# EAGLE schematic TowerPro 25A (HH30A_V1.1) (EAGLE 6.2)
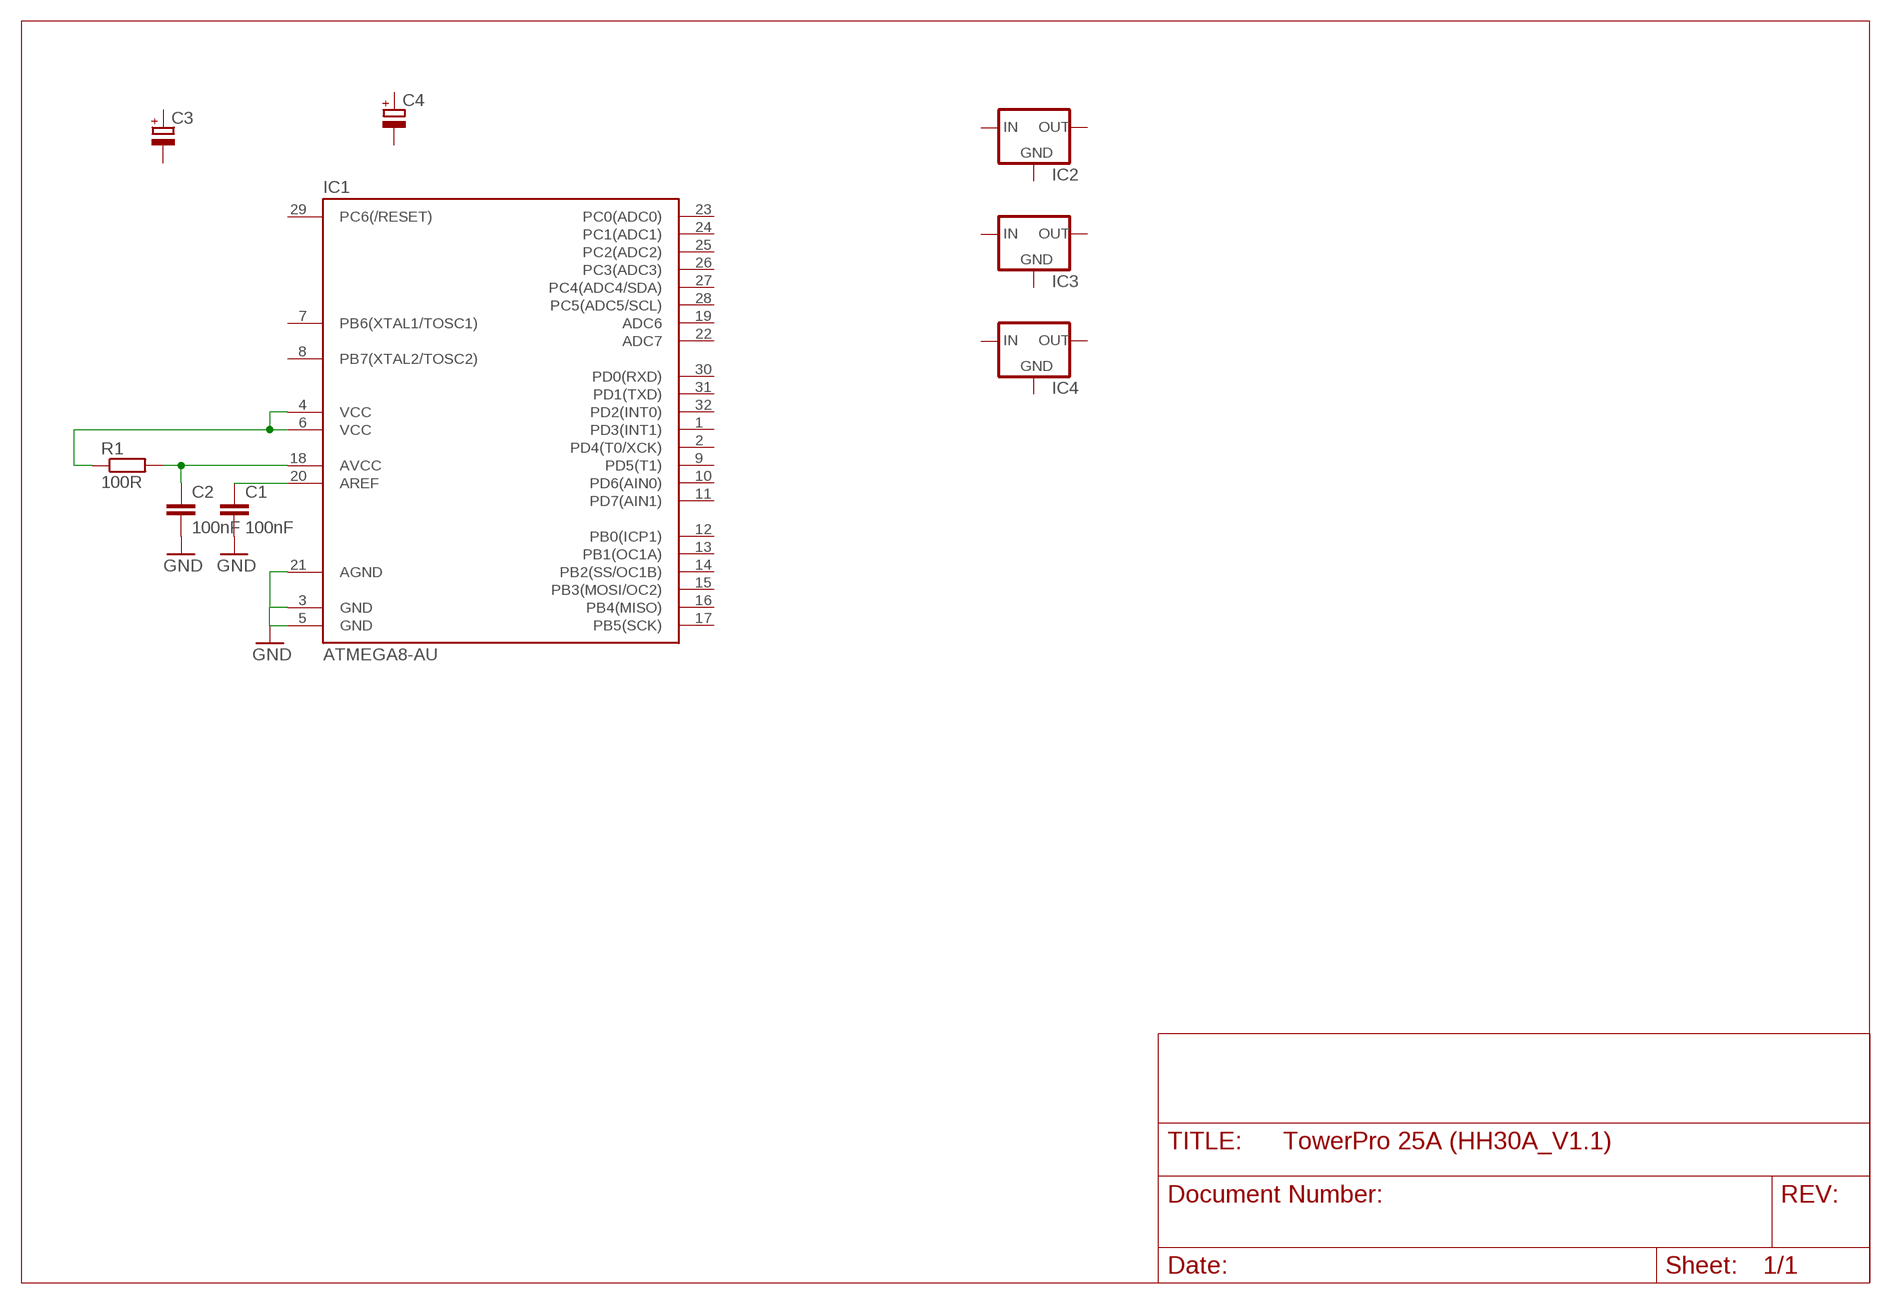
[diagram p0: schematic, sheet 1]

## Parts
C1  100nF  C2,5-3  [C2.5-3]
C2  100nF  C2,5-3  [C2.5-3]
C3  CPOL-EUE3.5-10  [E3,5-10]
C4  CPOL-EUE3.5-10  [E3,5-10]
IC1  ATMEGA8-AU  [TQFP32-08]
IC2  78MXXL  [78MXXL]
IC3  78MXXL  [78MXXL]
IC4  78MXXL  [78MXXL]
R1  100R  R-EU_M1206  [M1206]

## Nets
GND: C1.2 C2.2 IC1.3(GND) IC1.5(GND) IC1.21(AGND)
N$1: C1.1 IC1.20(AREF)
N$2: C2.1 IC1.18(AVCC) R1.2
N$3: IC1.4(VCC) IC1.6(VCC) R1.1
Unconnected: C3.+ C3.- C4.+ C4.- IC1.1(PD3(INT1)) IC1.2(PD4(T0/XCK)) IC1.7(PB6(XTAL1/TOSC1)) IC1.8(PB7(XTAL2/TOSC2)) IC1.9(PD5(T1)) IC1.10(PD6(AIN0)) IC1.11(PD7(AIN1)) IC1.12(PB0(ICP1)) IC1.13(PB1(OC1A)) IC1.14(PB2(SS/OC1B)) IC1.15(PB3(MOSI/OC2)) IC1.16(PB4(MISO)) IC1.17(PB5(SCK)) IC1.19(ADC6) IC1.22(ADC7) IC1.23(PC0(ADC0)) IC1.24(PC1(ADC1)) IC1.25(PC2(ADC2)) IC1.26(PC3(ADC3)) IC1.27(PC4(ADC4/SDA)) IC1.28(PC5(ADC5/SCL)) IC1.29(PC6(/RESET)) IC1.30(PD0(RXD)) IC1.31(PD1(TXD)) IC1.32(PD2(INT0)) IC2.GND IC2.IN IC2.OUT IC3.GND IC3.IN IC3.OUT IC4.GND IC4.IN IC4.OUT

## Library data of the parts
C1 C2 = capacitor-wima:C: CAPACITOR naming: grid - package width
C3 C4 = rcl:CPOL-EU: POLARIZED CAPACITOR, European symbol
IC1 = atmega8:ATMEGA8
IC2-IC4 = v-reg:78MXXL: VOLTAGE REGULATOR
R1 = resistor:R-EU_: RESISTOR, European symbol